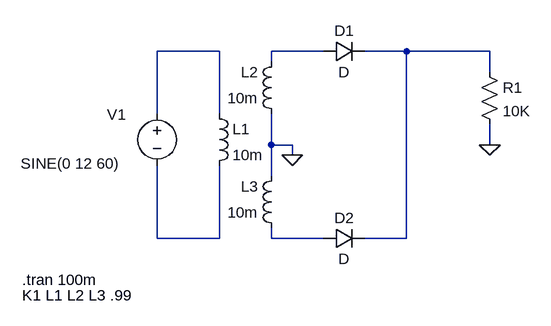
[diagram p0: schematic full_wave_trans.asc]
full_wave_trans.asc, the LTspice schematic file:
Version 4.1
SHEET 1 880 680
WIRE 144 48 48 48
WIRE 304 48 224 48
WIRE 432 48 368 48
WIRE 560 48 432 48
WIRE 224 64 224 48
WIRE 560 80 560 48
WIRE 48 144 48 48
WIRE 144 144 144 48
WIRE 224 192 224 144
WIRE 256 192 224 192
WIRE 560 192 560 160
WIRE 256 208 256 192
WIRE 224 240 224 192
WIRE 48 336 48 224
WIRE 144 336 144 224
WIRE 144 336 48 336
WIRE 224 336 224 320
WIRE 304 336 224 336
WIRE 432 336 432 48
WIRE 432 336 368 336
FLAG 256 208 0
FLAG 560 192 0
SYMBOL voltage 48 128 R0
WINDOW 0 -77 17 Left 2
WINDOW 3 -210 93 Left 2
WINDOW 123 0 0 Left 0
WINDOW 39 0 0 Left 0
SYMATTR InstName V1
SYMATTR Value SINE(0 12 60)
SYMBOL ind 128 128 R0
SYMATTR InstName L1
SYMATTR Value 10m
SYMATTR Type ind
SYMATTR SpiceLine Rser=1m
SYMBOL ind 240 160 R180
WINDOW 0 36 80 Left 2
WINDOW 3 36 40 Left 2
SYMATTR InstName L2
SYMATTR Value 10m
SYMATTR Type ind
SYMATTR SpiceLine Rser=1m
SYMBOL ind 240 336 R180
WINDOW 0 36 80 Left 2
WINDOW 3 36 40 Left 2
SYMATTR InstName L3
SYMATTR Value 10m
SYMATTR Type ind
SYMATTR SpiceLine Rser=1m
SYMBOL diode 304 64 R270
WINDOW 0 32 32 VTop 2
WINDOW 3 0 32 VBottom 2
SYMATTR InstName D1
SYMBOL diode 304 352 R270
WINDOW 0 32 32 VTop 2
WINDOW 3 0 32 VBottom 2
SYMATTR InstName D2
SYMBOL res 544 64 R0
SYMATTR InstName R1
SYMATTR Value 10K
TEXT -160 400 Left 2 !.tran 100m
TEXT -160 424 Left 2 !K1 L1 L2 L3 .99

The netlist it stands for:
* full_wave_trans.asc
V1 N001 N004 SINE(0 12 60)
L1 N001 N004 10m Rser=1m
L2 0 N002 10m Rser=1m
L3 N005 0 10m Rser=1m
D1 N002 N003 D
D2 N005 N003 D
R1 N003 0 10K
.model D D
.lib standard.dio
.tran 100m
K1 L1 L2 L3 .99
.backanno
.end